# Altium schematic sheet Э3_1.SchDoc: плата
size 420 x 297 mm; DrawnBy: Каверзнев; DocumentNumber: Э3; SheetNumber: 1; SheetTotal: 2; Title1str: Ремонт Труб; DocumentType: схема электрическая принципиальная; Format: A3; ImagePath: 1
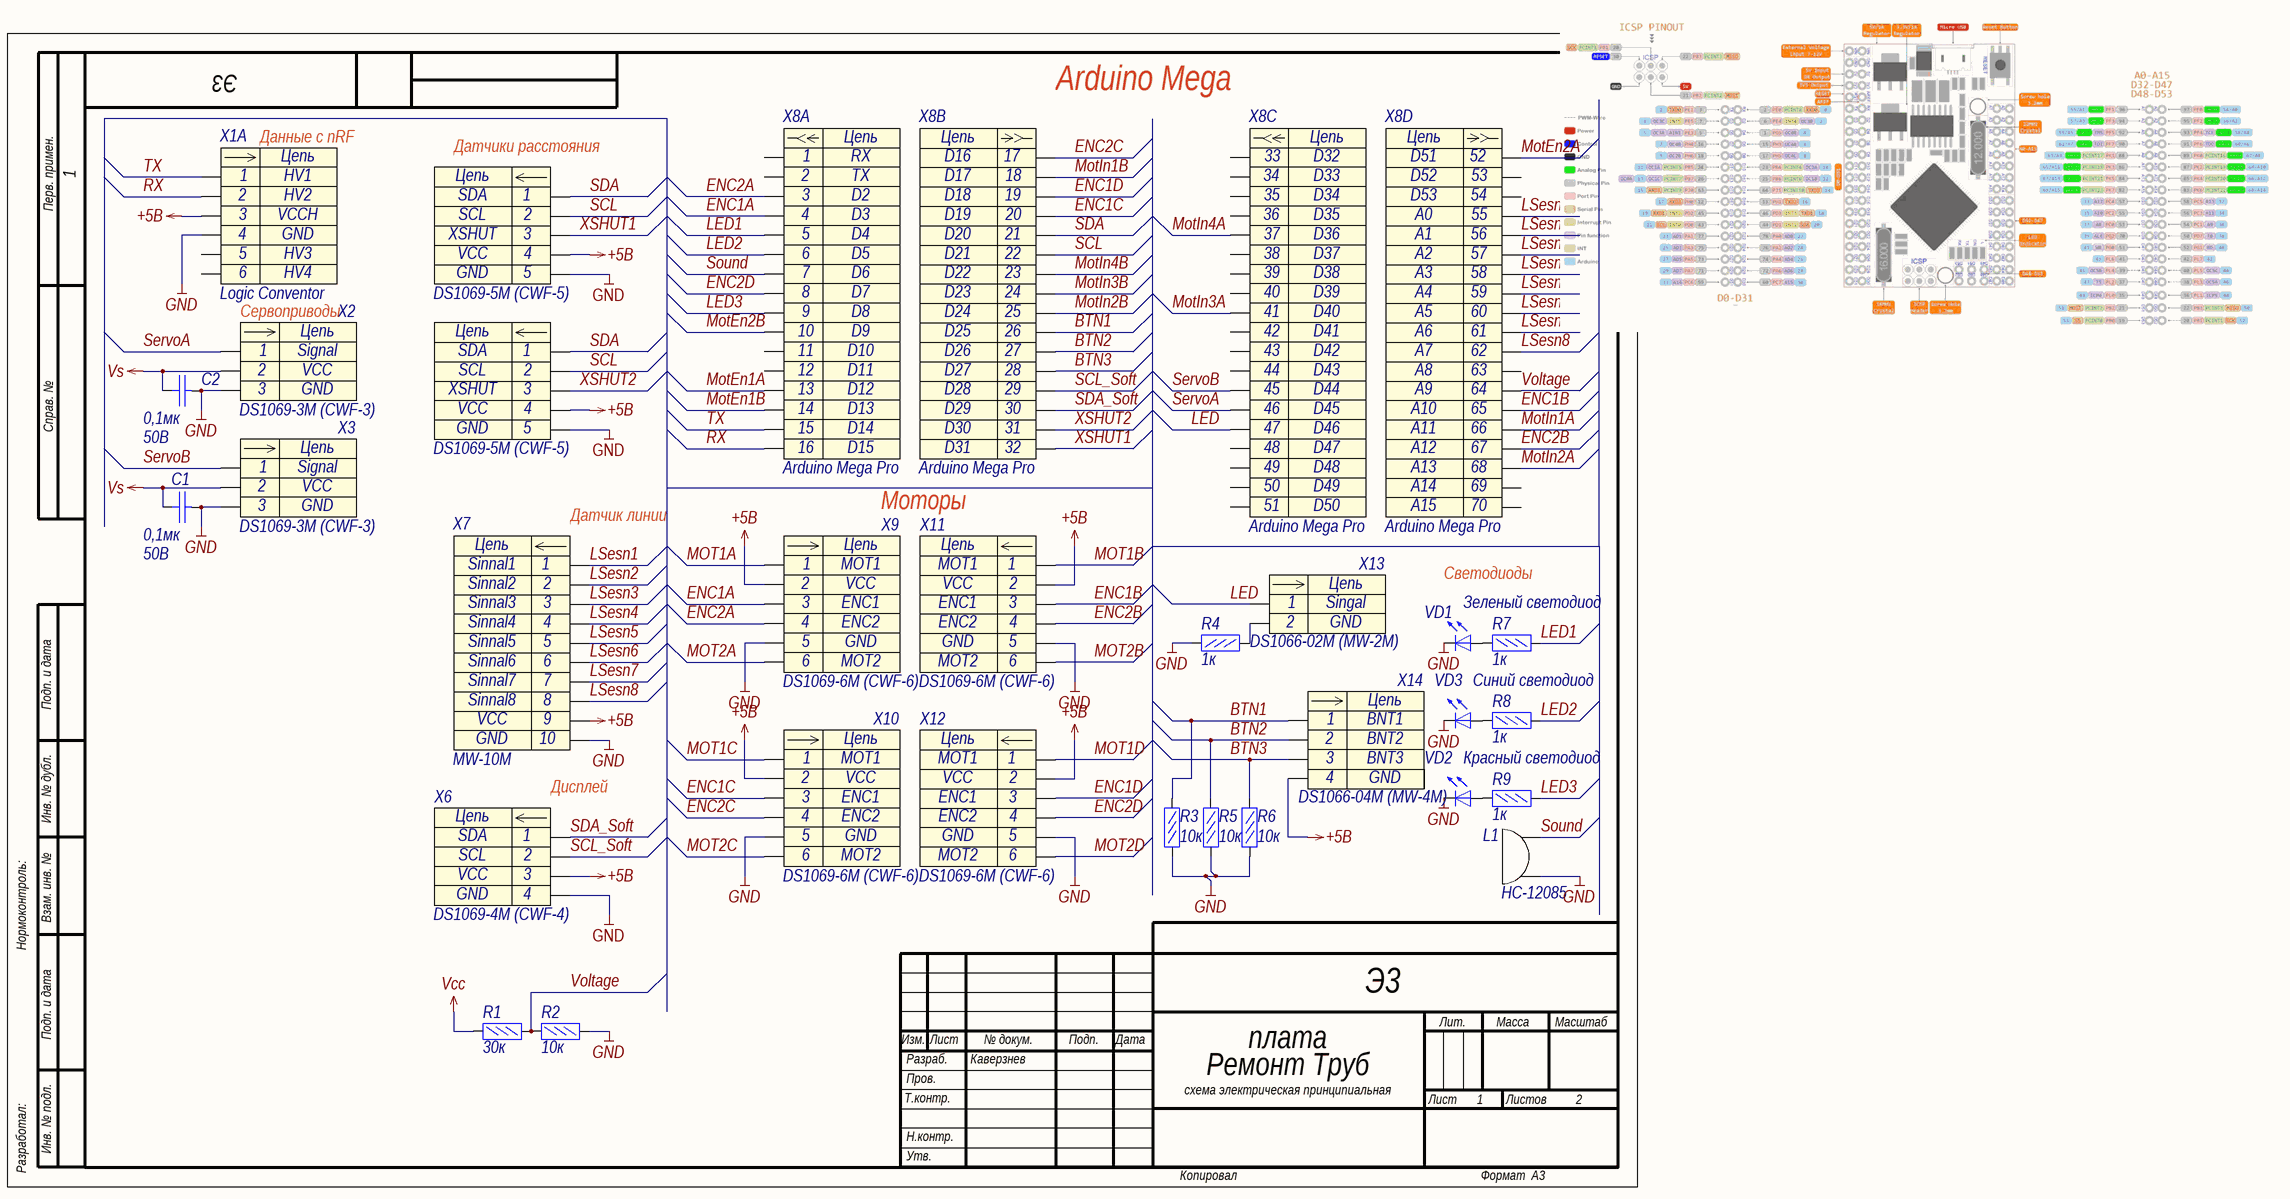
[diagram p0: Э3_1.SchDoc]

## Parts
C1  Voltage: 50В  [C0603]  (hidden comment: 0,1мк)
C2  Voltage: 50В  [C0603]  (hidden comment: 0,1мк)
L1  HC-12085  [Buzzer]
R1  30к  [R0603]
R2  10к  [R0603]
R3  10к  [R0603]
R4  1к  [R0603]
R5  10к  [R0603]
R6  10к  [R0603]
R7  1к  [R0603]
R8  1к  [R0603]
R9  1к  [R0603]
VD1  Зеленый светодиод  [VD0603]
VD2  Красный светодиод  [VD0603]
VD3  Синий светодиод  [VD0603]
X1  Logic Conventor  [LOGIC CONVENTOR]  (part A of 2)
X2  DS1069-3M (CWF-3)  [CWF-3]
X3  DS1069-3M (CWF-3)  [CWF-3]
X4  DS1069-5M (CWF-5)  [CWF-5]
X5  DS1069-5M (CWF-5)  [CWF-5]
X6  DS1069-4M (CWF-4)  [CWF-4]
X7  MW-10M  [MW-10M]
X8  Arduino Mega Pro  [Arduino Mega Pro Mini]  (parts A,B,C,D of 5)
X9  DS1069-6M (CWF-6)  [CWF-6]
X10  DS1069-6M (CWF-6)  [CWF-6]
X11  DS1069-6M (CWF-6)  [CWF-6]
X12  DS1069-6M (CWF-6)  [CWF-6]
X13  DS1066-02M (MW-2M)  [MW-2M]
X14  DS1066-04M (MW-4M)  [MW-4M]

## Nets
+5B: X1.3 X4.4 X5.4 X6.3 X7.9 X9.2 X10.2 X11.2 X12.2 X14.4
GND: C1.2 C2.2 L1.2 R2.2 R3.1 R4.2 R5.1 R6.1 VD1.2(K) VD2.2(K) VD3.2(K) X1.4 X2.3 X3.3 X4.5 X5.5 X6.4 X7.10 X9.5 X10.5 X11.5 X12.5
Vcc: R1.1
Vs: C1.1 C2.1 X2.2 X3.2
BTN1: R3.2 X8.26 X14.1
BTN2: R5.2 X8.27 X14.2
BTN3: R6.2 X8.28 X14.3
ENC1A: X8.4 X9.3
ENC1B: X8.65 X11.3
ENC1C: X8.20 X10.3
ENC1D: X8.19 X12.3
ENC2A: X8.3 X9.4
ENC2B: X8.67 X11.4
ENC2C: X8.17 X10.4
ENC2D: X8.8 X12.4
LED: X8.47 X13.1
LED1: R7.2 X8.5
LED2: R8.2 X8.6
LED3: R9.2 X8.9
LSesn1: X7.1 X8.55
LSesn2: X7.2 X8.56
LSesn3: X7.3 X8.57
LSesn4: X7.4 X8.58
LSesn5: X7.5 X8.59
LSesn6: X7.6 X8.60
LSesn7: X7.7 X8.61
LSesn8: X7.8 X8.62
MOT1A: X9.1
MOT1B: X11.1
MOT1C: X10.1
MOT1D: X12.1
MOT2A: X9.6
MOT2B: X11.6
MOT2C: X10.6
MOT2D: X12.6
MotEn1A: X8.13
MotEn1B: X8.14
MotEn2A: X8.52
MotEn2B: X8.10
MotIn1A: X8.66
MotIn1B: X8.18
MotIn2A: X8.68
MotIn2B: X8.25
MotIn3A: X8.41
MotIn3B: X8.24
MotIn4A: X8.37
MotIn4B: X8.23
RX: X1.2 X8.16
SCL: X4.2 X5.2 X8.22
SCL_Soft: X6.2 X8.29
SDA: X4.1 X5.1 X8.21
SDA_Soft: X6.1 X8.30
ServoA: X2.1 X8.46
ServoB: X3.1 X8.45
Sound: L1.1 X8.7
TX: X1.1 X8.15
Voltage: R1.2 R2.1 X8.64
XSHUT1: X4.3 X8.32
XSHUT2: X5.3 X8.31
NetR4_1: R4.1 X13.2
NetR7_1: R7.1 VD1.1(A)
NetR8_1: R8.1 VD3.1(A)
NetR9_1: R9.1 VD2.1(A)

Not connected (* = marked no-connect by the designer): X1 5 6; X8 1 2 11 12 33 34 35 36 38 39 40 42 43 44 48 49 50 51 53 54 63 69 70

## Notes on the sheet
- Arduino Mega
- Перв. примен.
- Данные с nRF
- (near X4) Датчики расстояния
- Сервоприводы
- Справ. №
- Моторы
- (near X7) Датчик линии
- Светодиоды
- Подп. и дата
- Инв. № дубл.
- Дисплей
- Нормоконтроль:
- Взам. инв. №
- Изм.
- Лист
- № докум.
- Подп.
- Дата
- Лит.
- Масса
- Масштаб
- Т.контр.
- Пров.
- Разраб.
- 1
- Листов
- 2
- Разработал:
- Инв. № подл.
- Н.контр.
- Утв.
- Копировал
- Формат
- (in symbol Arduino Mega Pro Mini, part A) Цепь; RX; TX; D2; D3; D4; D5; D6; D7; D8; D9; D10; D11; D12; D13; D14; D15
- (in symbol Arduino Mega Pro Mini, part B) Цепь; D16; D17; D18; D19; D20; D21; D22; D23; D24; D25; D26; D27; D28; D29; D30; D31; /
- (in symbol Arduino Mega Pro Mini, part C) Цепь; D32; D33; D34; D35; D36; D37; D38; D39; D40; D41; D42; D43; D44; D45; D46; D47; D48; D49; D50
- (in symbol Arduino Mega Pro Mini, part D) Цепь; D51; D52; D53; A0; A1; A2; A3; A4; A5; A6; A7; A8; A9; A10; A11; A12; A13; A14; A15
- (in symbol CWF-3) Цепь
- (in symbol CWF-4) Цепь
- (in symbol CWF-5) Цепь
- (in symbol CWF-6) Цепь
- (in symbol CWF-10) Цепь
- (in symbol Logic Conventor, part A) Цепь; HV1; HV2; VCCH; GND; HV3; HV4
- (in symbol MW-2M) Цепь
- (in symbol MW-4M) Цепь

## Library data of the parts
C1 C2 = GRM188R71H104KA93D: Конденсатор кер. 0,1мкФ 50В X7R; Manufacturer: Murata; Name: GRM188R71H104KA93D; TKE: X7R; Value: 0,1мк
L1 = HC-12085: Manufacturer: Epcos TDK; Name: HC-12085
R1 = RC0603FR-0730KL: Резистор 30кОм 0,063Вт 1%; Manufacturer: YAGEO; Name: RC0603FR-0730KL; Tolerance: 1%; Value: 30к
R2 R3 R5 R6 = RC0603FR-0710KL: Резистор 10кОм 0,063Вт 1%; Manufacturer: YAGEO; Name: RC0603FR-0710KL; Tolerance: 1%; Value: 10к
R4 R7-R9 = RC0603FR-071KL: Резистор 1кОм 0,063Вт 1%; Manufacturer: YAGEO; Name: RC0603FR-071KL; Tolerance: 1%; Value: 1к
VD1 = FYLS-0603BUGC: Светодтод зеленый SMD Foryard Optoelectronics Co.; Name: Зеленый светодиод
VD2 = FYLS-0603BURC: Светодтод красный SMD Foryard Optoelectronics Co.; Name: Красный светодиод
VD3 = FYLS-0603BUBC: Светодтод синий SMD Foryard Optoelectronics Co.; Name: Синий светодиод
X1 = Logic Conventor: Преобразователь уровней; Name: Logic Conventor
X2 X3 = CWF-3: Разъем - 3 конт. прямая вилка на плату; Contact_1: Signal; Contact_2: VCC; Contact_3: GND; Name: DS1069-3M (CWF-3)
X4 X5 = CWF-5: Разъем - 5 конт. прямая вилка на плату; Contact_1: SDA; Contact_2: SCL; Contact_3: XSHUT; Contact_4: VCC; Contact_5: GND; Contact_6: Contact_6; Name: DS1069-5M (CWF-5)
X6 = CWF-4: Разъем - 4 конт. прямая вилка на плату; Contact_1: SDA; Contact_2: SCL; Contact_3: VCC; Contact_4: GND; Name: DS1069-4M (CWF-4)
X7 = CWF-10: Contact_1: Sinnal1; Contact_2: Sinnal2; Contact_3: Sinnal3; Contact_4: Sinnal4; Contact_5: Sinnal5; Contact_6: Sinnal6; Contact_7: Sinnal7; Contact_8: Sinnal8; Contact_9: VCC; Contact_10: GND; Name: MW-10M
X8 = Arduino Mega Pro Mini: Name: Arduino Mega Pro
X9-X12 = CWF-6: Разъем - 6 конт. прямая вилка на плату; Contact_1: MOT1; Contact_2: VCC; Contact_3: ENC1; Contact_4: ENC2; Contact_5: GND; Contact_6: MOT2; Name: DS1069-6M (CWF-6)
X13 = MW-2M: Разъем - 2 конт. прямая вилка на плату; Contact_1: Singal; Contact_2: GND; Name: DS1066-02M (MW-2M)
X14 = MW-4M: Разъем - 4 конт. прямая вилка на плату; Contact_1: BNT1; Contact_2: BNT2; Contact_3: BNT3; Contact_4: GND; Name: DS1066-04M (MW-4M)